# Altium project Finished.PrjPCB
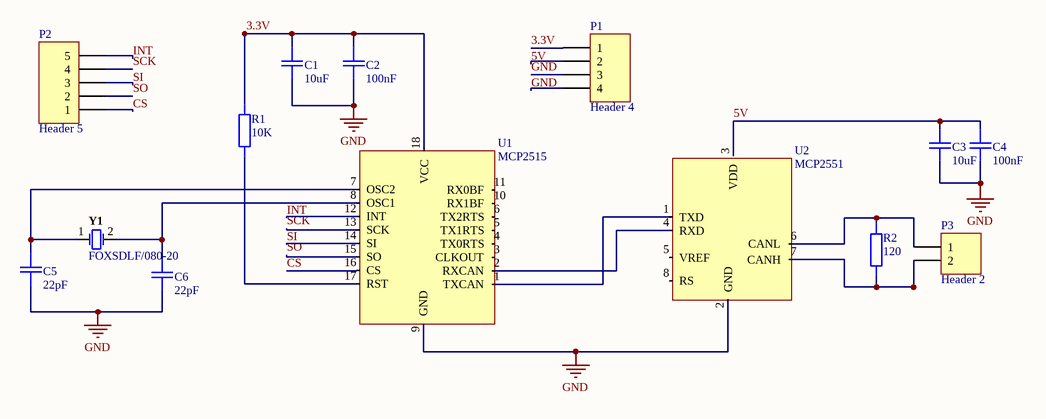
[diagram p0: Main Schematic.SchDoc]
1 sheet, 14 parts. Net scope: global (net labels, ports and power ports of the same name join across sheets).
Board file: PCB.PcbDoc

## Sheet Main Schematic.SchDoc
size A4

### Parts
C1  value 10uF  [CAP0805]  (hidden comment: Capacitor)
C2  value 100nF  [CAP0805]  (hidden comment: Capacitor)
C3  value 10uF  [CAP0805]  (hidden comment: Capacitor)
C4  value 100nF  [CAP0805]  (hidden comment: Capacitor)
C5  value 22pF  [CAP0805]  (hidden comment: Capacitor)
C6  value 22pF  [CAP0805]  (hidden comment: Capacitor)
P1  Header 4  [HDR1X4]
P2  Header 5  [HDR1X5]
P3  Header 2  [HDR1X2]
R1  value 10K  [6-0805_L]  (hidden comment: Resistor)
R2  value 120  [6-0805_L]  (hidden comment: Resistor)
U1  MCP2515  [TSSOP 20-lead 4.4mm]
U2  MCP2551  [SOIC 8-LEAD SN]
Y1  FOXSDLF/080-20  [FOX-HC49SDLF_V]

### Nets
GND: C1.2 C2.2 C3.2 C4.2 C5.2 C6.2 P1.3 P1.4 U1.9(GND) U2.2(GND)
3.3V: C1.1 C2.1 P1.1 R1.2 U1.18(VCC)
5V: C3.1 C4.1 P1.2 U2.3(VDD)
CS: P2.1 U1.16(CS)
INT: P2.5 U1.12(INT)
SCK: P2.4 U1.13(SCK)
SI: P2.3 U1.14(SI)
SO: P2.2 U1.15(SO)
NetC5_1: C5.1 U1.7(OSC2) Y1.1
NetC6_1: C6.1 U1.8(OSC1) Y1.2
NetP3_1: P3.1 R2.2 U2.6(CANL)
NetP3_2: P3.2 R2.1 U2.7(CANH)
NetR1_1: R1.1 U1.17(RST)
NetU1_1: U1.1(TXCAN) U2.1(TXD)
NetU1_2: U1.2(RXCAN) U2.4(RXD)

Not connected (* = marked no-connect by the designer): U1 3(CLKOUT) 4(TX0RTS) 5(TX1RTS) 6(TX2RTS) 10(RX1BF) 11(RX0BF); U2 5(VREF) 8(RS)

### Library data of the parts
C1 C3 = Capacitor: Voltage: 10V; Tolerance: 20%; Package: 0805
C2 C4-C6 = Capacitor: Voltage: 16V; Tolerance: 10%; Package: 0603
P1 = Header 4: Header, 4-Pin; LatestRevisionDate: 17-Jul-2002; LatestRevisionNote: Re-released for DXP Platform.; Publisher: Altium Limited
P2 = Header 5: Header, 5-Pin; LatestRevisionDate: 17-Jul-2002; LatestRevisionNote: Re-released for DXP Platform.; Publisher: Altium Limited
P3 = Header 2: Header, 2-Pin; LatestRevisionDate: 17-Jul-2002; LatestRevisionNote: Re-released for DXP Platform.; Publisher: Altium Limited
R1 R2 = Resistor: Tolerance: 1%; Power Rating: 1/4W; Package: 0602
Y1 = CMP-2100-03639-1: Resistance Weld Crystal, 8 MHz, +/- 30 ppm, -20 to 70 degC, 2-Pin SMD, RoHS, Tape and Reel; Manufacturer: FOX Electronics; Series Resistance: 80Ohm; Frequency: 8MHz; Load Capacitance: 20pF; Tolerance: 50ppm; Frequency Tolerance: 30ppm; Datasheet URL: http://www.foxonline.com/pdfs/hc49sdlf.pdf; Package Reference: HC49SDLF; Height: 4.5mm; Mount: SurfaceMount; Packaging: TapeandReel; Length: 11.7mm; Termination: SMD/SMT; Number of Pins: 2; Depth: 5mm; Min Operating Temperature: -20degC; Package Quantity: 1000; RoHSCompliant: True; Lead Free: LeadFree; Width: 5mm; Case/Package: SMD/SMT; Manufacturer URL: http://www.foxonline.com/; Max Operating Temperature: 70degC; REACH SVHC: NoSVHC; Datasheet Version: 42064.0; Package Description: 2-Pin Surface Mount Device, Body 5 x 11.7 mm; Frequency Stability: 50ppm; ESR (Equivalent Series Resistance): 80Ohm; Radiation Hardening: No
U1 = MCP2515: ComponentLink1Description: MOUSER; ComponentLink1URL: https://no.mouser.com/ProductDetail/Microchip-Technology/MCP2515-I-SO?qs=KwArPi4cUogGDbGnphOvtQ==
U2 = MCP2551: ComponentLink1Description: MCP2551; ComponentLink1URL: https://no.mouser.com/datasheet/2/268/20001667G-1115479.pdf